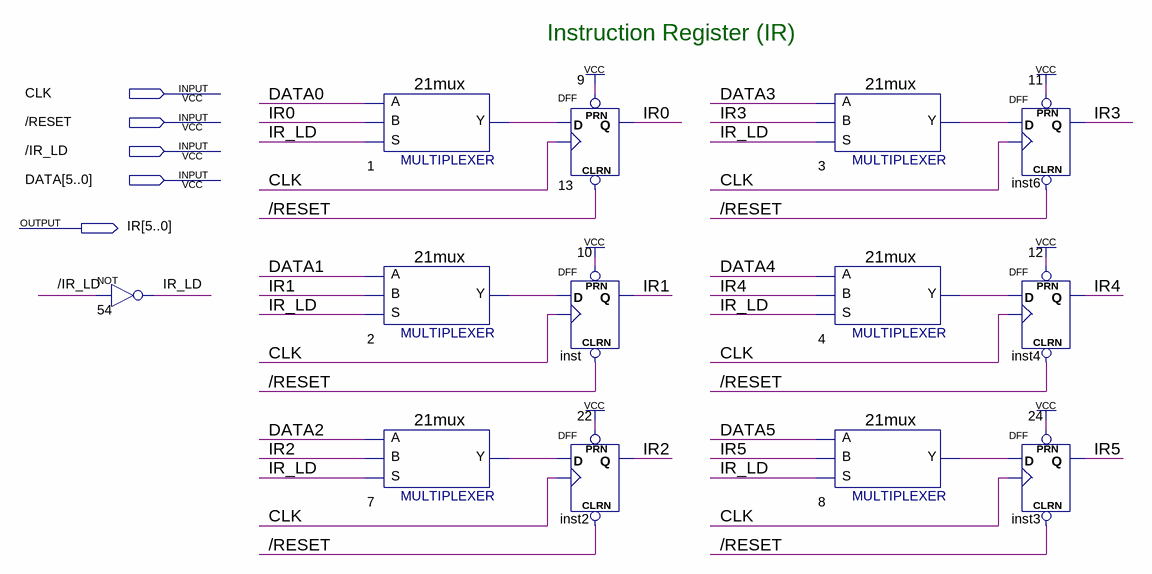
[diagram p0: schematic sheet]
// Quartus schematic ir.bdf as structural Verilog: 13 symbols, 5 pins
module ir (
  input  CLK,
  input  \/RESET ,
  input  \/IR_LD ,
  input  [5:0] DATA,
  output [5:0] IR
);

  wire IR_LD, n1_y, n2_y, n3_y, n4_y, n7_y, n8_y;

  not u_54 (IR_LD, \/IR_LD );
  \21mux  u_1 (.A(DATA[0]), .B(IR[0]), .S(IR_LD), .Y(n1_y));
  \21mux  u_2 (.A(DATA[1]), .B(IR[1]), .S(IR_LD), .Y(n2_y));
  \21mux  u_7 (.A(DATA[2]), .B(IR[2]), .S(IR_LD), .Y(n7_y));
  DFF u_13 (.CLRN(\/RESET ), .CLK(CLK), .D(n1_y), .PRN(1'b1), .Q(IR[0]));
  DFF inst (.CLRN(\/RESET ), .CLK(CLK), .D(n2_y), .PRN(1'b1), .Q(IR[1]));
  DFF inst2 (.CLRN(\/RESET ), .CLK(CLK), .D(n7_y), .PRN(1'b1), .Q(IR[2]));
  \21mux  u_3 (.A(DATA[3]), .B(IR[3]), .S(IR_LD), .Y(n3_y));
  \21mux  u_4 (.A(DATA[4]), .B(IR[4]), .S(IR_LD), .Y(n4_y));
  \21mux  u_8 (.A(DATA[5]), .B(IR[5]), .S(IR_LD), .Y(n8_y));
  DFF inst6 (.CLRN(\/RESET ), .CLK(CLK), .D(n3_y), .PRN(1'b1), .Q(IR[3]));
  DFF inst4 (.CLRN(\/RESET ), .CLK(CLK), .D(n4_y), .PRN(1'b1), .Q(IR[4]));
  DFF inst3 (.CLRN(\/RESET ), .CLK(CLK), .D(n8_y), .PRN(1'b1), .Q(IR[5]));

  // Notes on the sheet:
  //   Instruction Register (IR)
endmodule
